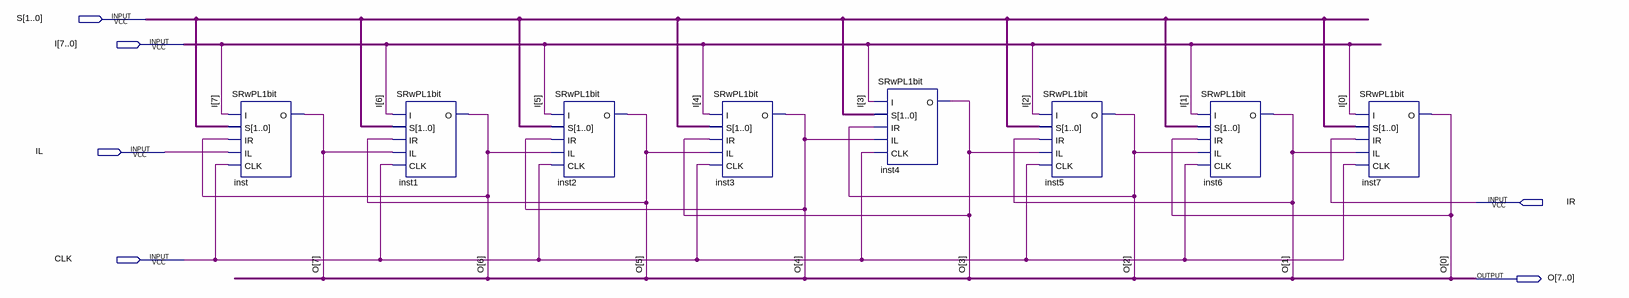
[diagram p0: schematic sheet]
// Quartus schematic SRwPL.bdf as structural Verilog: 8 symbols, 6 pins
module SRwPL (
  input  [1:0] S,
  input  [7:0] I,
  input  IL,
  input  IR,
  input  CLK,
  output [7:0] O
);

  SRwPL1bit inst (.I(I[7]), .S(S), .IR(O[6]), .IL(IL), .CLK(CLK), .O(O[7]));
  SRwPL1bit inst1 (.I(I[6]), .S(S), .IR(O[5]), .IL(O[7]), .CLK(CLK), .O(O[6]));
  SRwPL1bit inst2 (.I(I[5]), .S(S), .IR(O[4]), .IL(O[6]), .CLK(CLK), .O(O[5]));
  SRwPL1bit inst3 (.I(I[4]), .S(S), .IR(O[3]), .IL(O[5]), .CLK(CLK), .O(O[4]));
  SRwPL1bit inst4 (.I(I[3]), .S(S), .IR(O[2]), .IL(O[4]), .CLK(CLK), .O(O[3]));
  SRwPL1bit inst5 (.I(I[2]), .S(S), .IR(O[1]), .IL(O[3]), .CLK(CLK), .O(O[2]));
  SRwPL1bit inst6 (.I(I[1]), .S(S), .IR(O[0]), .IL(O[2]), .CLK(CLK), .O(O[1]));
  SRwPL1bit inst7 (.I(I[0]), .S(S), .IR(IR), .IL(O[1]), .CLK(CLK), .O(O[0]));
endmodule
